# EAGLE design XT-02_Eyecillator_CEMC (EAGLE 9.6.2)
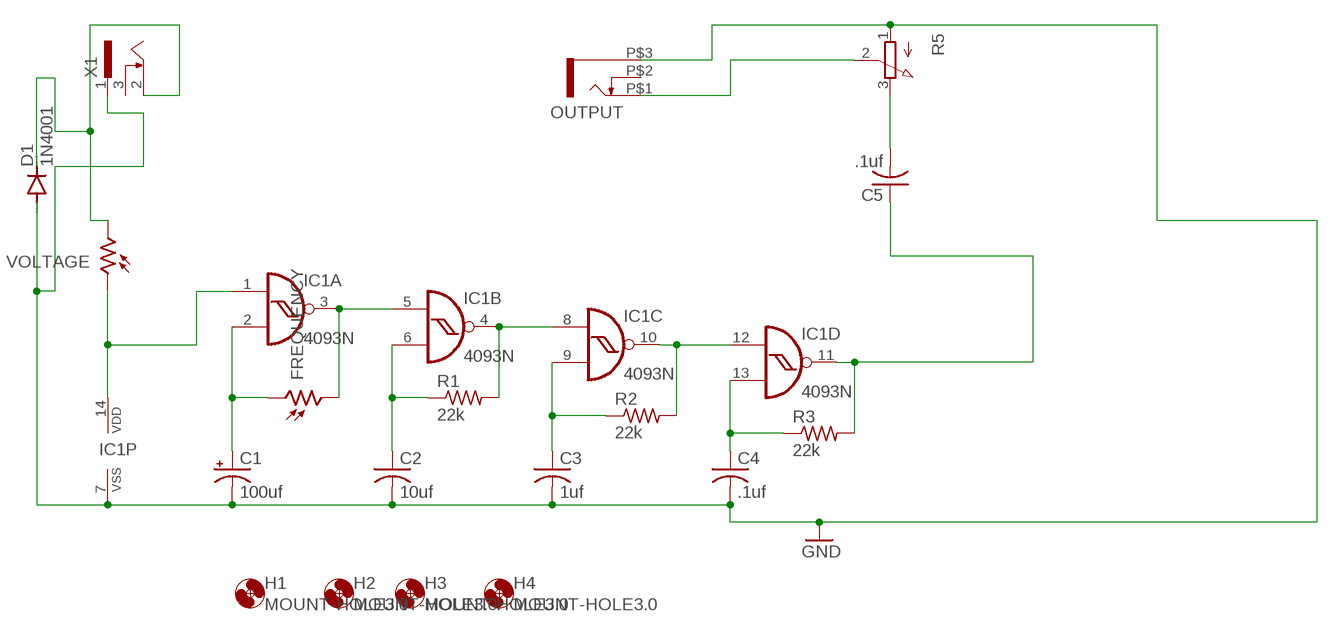
[diagram p0: schematic, sheet 1]

## Parts
C1  100uf  CPOL-USE2,5-6E  [E2,5-6E]
C2  10uf  C-US050-025X075  [C050-025X075]
C3  1uf  C-US050-025X075  [C050-025X075]
C4  .1uf  C-US050-025X075  [C050-025X075]
C5  .1uf  C-US050-025X075  [C050-025X075]
D1  1N4001  1N4004  [DO41-10]
FREQUENCY  VT90N1  [VT900]
H1  MOUNT-HOLE3.0  [3,0]
H2  MOUNT-HOLE3.0  [3,0]
H3  MOUNT-HOLE3.0  [3,0]
H4  MOUNT-HOLE3.0  [3,0]
IC1  4093N  [DIL14]
OUTPUT  WQP-PJ301M-12_JACK  [WQP-PJ301M-12_JACK]
R1  22k  R-US_0207/7  [0207/7]
R2  22k  R-US_0207/7  [0207/7]
R3  22k  R-US_0207/7  [0207/7]
R5  EVUF2L  [EVUFXL]
VOLTAGE  VT90N1  [VT900]
X1  SCD-014A  [SCD-014-A]

## Nets
GND: C1.- C2.2 C3.2 C4.2 D1.A IC1.7(P:VSS) OUTPUT.P$3 R5.1(A) X1.1
N$1: FREQUENCY.2 IC1.3(A:O) IC1.5(B:I0)
N$2: IC1.4(B:O) IC1.8(C:I0) R1.2
N$3: IC1.10(C:O) IC1.12(D:I0) R2.2
N$4: C1.+ FREQUENCY.1 IC1.2(A:I1)
N$5: C2.1 IC1.6(B:I1) R1.1
N$6: C3.1 IC1.9(C:I1) R2.1
N$7: C4.1 IC1.13(D:I1) R3.1
N$8: C5.2 R5.3(E)
N$9: IC1.1(A:I0) IC1.14(P:VDD) VOLTAGE.1
N$10: C5.1 IC1.11(D:O) R3.2
N$11: OUTPUT.P$1 R5.2(S)
N$18: D1.C VOLTAGE.2 X1.2
Unconnected: OUTPUT.P$2 X1.3

## Library data of the parts
C1 = rcl:CPOL-US: POLARIZED CAPACITOR, American symbol; SPICEPREFIX: C
C2-C5 = rcl:C-US: CAPACITOR, American symbol; SPICEPREFIX: C
D1 = diode:1N4004: DIODE general purpose rectifier, 1 A
FREQUENCY VOLTAGE = photo-elements:VT9: Photoconductive Cell VT900 Series Source: http://optoelectronics.perkinelmer.com/content/Datasheets/DTS_vt900seriesdatasheet.pdf
H1-H4 = holes:MOUNT-HOLE: MOUNTING HOLE with drill center marker
IC1 = 40xx:4093: Quad 2-input NAND schmitt trigger
OUTPUT = thonkiconn:WQP-PJ301M-12_JACK
R1-R3 = rcl:R-US_: RESISTOR, American symbol; SPICEPREFIX: R
R5 = pot:EVU: 9 mm Square Rotary Potentiometers Source: Panasonic
X1 = con-shiua-chyuan:SCD-014A: Power Jack 2.5mm; OC_FARNELL: unknown; OC_NEWARK: unknown

## Board
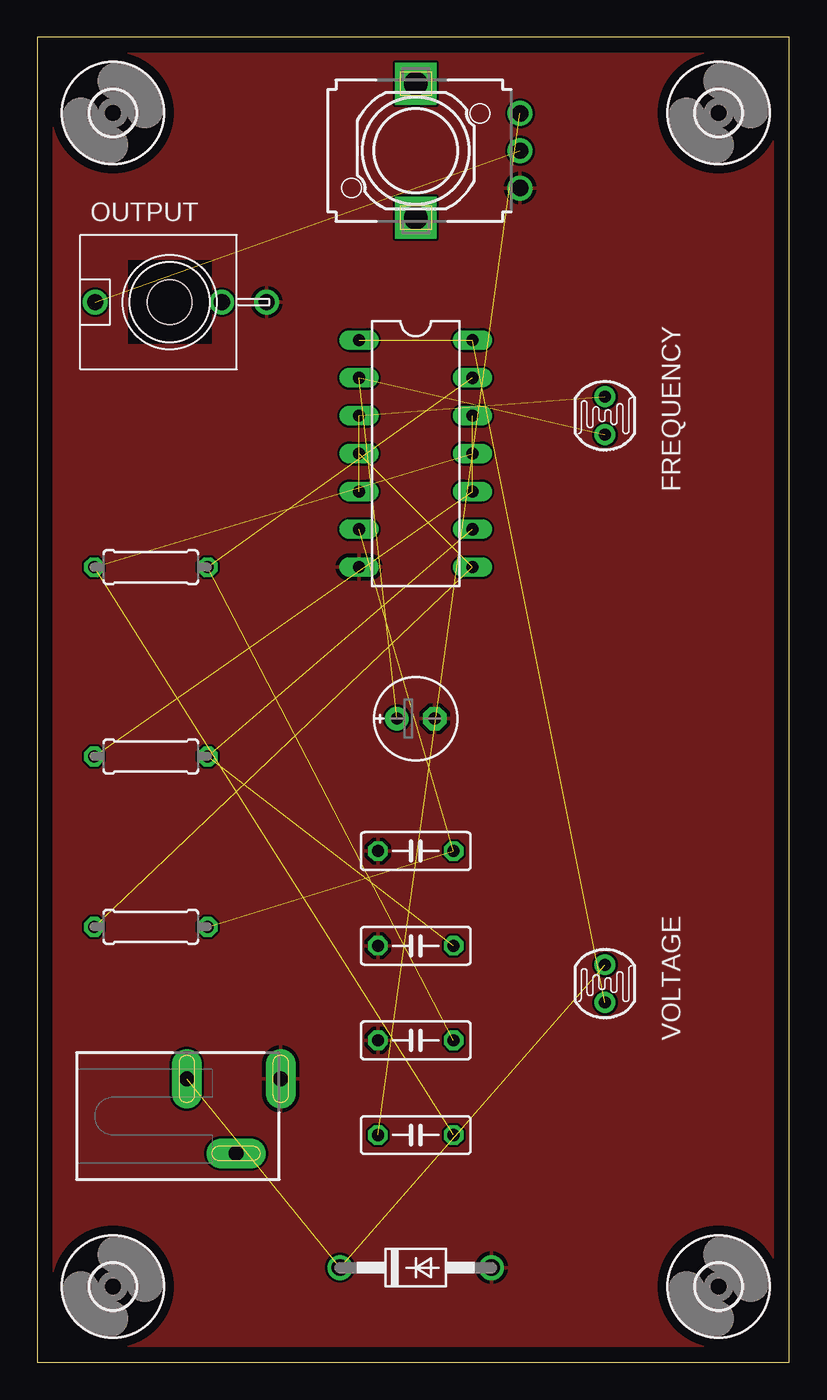
[diagram p1: board, top side]
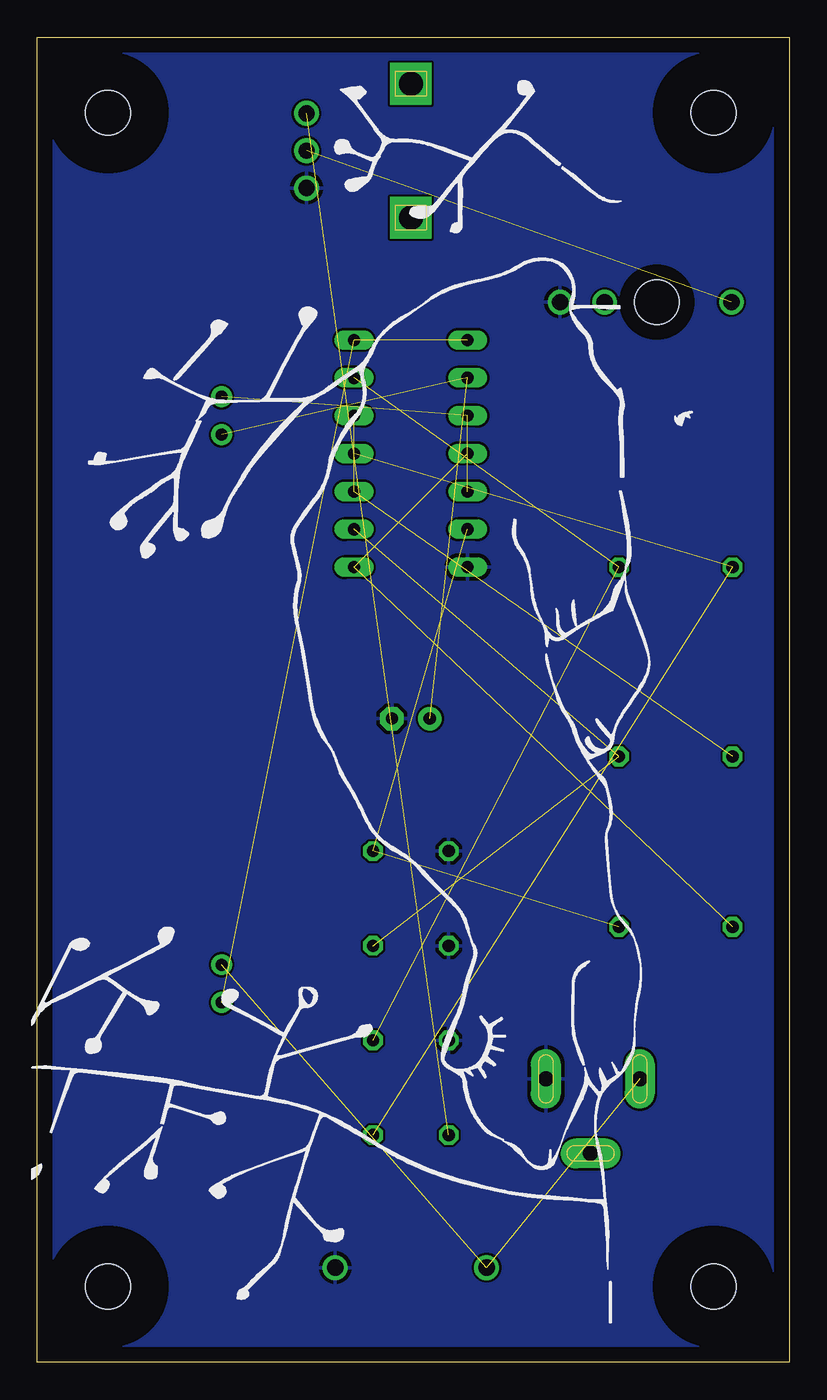
[diagram p2: board, bottom side, seen from below]

Size 50.47 x 88.89 mm. Coordinates in mm from the lower left corner, seen from the top.
Outline: 0,0 50.47,0 50.47,88.89 0,88.89 0,0
Copper layers (1*16): Top 0.035mm / dielectric 1.5mm / Bottom 0.035mm
Design rules "default": minimum track width 6mil, minimum drill 0.35mm, track to track 6mil, track to pad 6mil, pad to pad 6mil, via to via 6mil, smd to smd 6mil, copper to edge 40mil, drill to drill 6mil, minimum pad ring 10mil, minimum via ring 8mil, stop-mask expansion 4mil, vias tented up to drill 0mil, thermal gap 10mil
Holes 3 mm at 8.89,71.12

### Footprints (pad centres in the part's own frame; a part is rotated, then mirrored left to right if it is on the bottom)
E2,5-6E = drill 0.813 pad 1.575: + -1.27,0 | drill 0.813 pad 1.575 octagon: - 1.27,0
C050-025X075 = drill 0.813 octagon: 1 -2.54,0; 2 2.54,0
DO41-10 = drill 1.118: A 5.08,0; C -5.08,0
VT900 = drill 0.8 pad 1.4: 1 -1.27,0; 2 1.27,0
3,0 = hole 3: 0,0
DIL14 = drill 0.813 long: 1 -7.62,-3.81; 2 -5.08,-3.81; 3 -2.54,-3.81; 4 0,-3.81; 5 2.54,-3.81; 6 5.08,-3.81; 7 7.62,-3.81; 8 7.62,3.81; 9 5.08,3.81; 10 2.54,3.81; 11 0,3.81; 12 -2.54,3.81; 13 -5.08,3.81; 14 -7.62,3.81
WQP-PJ301M-12_JACK = drill 1.1: P$1 0,5; P$2 0,-3.5; P$3 0,-6.5
0207/7 = drill 0.813 octagon: 1 -3.81,0; 2 3.81,0
EVUFXL = drill 1.1 pad 1.676: 1 -2.5,-7; 2 0,-7; 3 2.5,-7 | drill 1.6 pad 2.8 square: M1 4.5,0; M2 -4.5,0
SCD-014-A = drill 1 pad 2 long: 1 -2.5,13.8; 2 -2.5,7.5; 3 2.5,10.8

### Placement (x,y rotation side)
C1  25.4,43.18 0 top
C2  25.4,34.29 180 top
C3  25.4,27.94 180 top
C4  25.4,21.59 180 top
C5  25.4,15.24 180 top
D1  25.4,6.35 0 top
FREQUENCY  38.1,63.5 90 top
H1  45.72,83.82 0 top
H2  5.08,83.82 0 top
H3  45.72,5.08 0 top
H4  5.08,5.08 0 top
IC1  25.4,60.96 270 top
OUTPUT  8.89,71.12 90 top
R1  7.62,29.21 180 top
R2  7.62,40.64 180 top
R3  7.62,53.34 180 top
R5  25.4,81.28 90 top
VOLTAGE  38.1,25.4 90 top
X1  2.54,16.51 270 top

### Tracks (layer width: path | path; a pad name or v marks a point on that pad's centre or on a via)
GND
  pour Top: 0,88.9 50.8,88.9 50.8,0 0,0
  pour Bottom: 0,88.9 50.8,88.9 50.8,0 0,0
N$1  (2 unrouted)
N$2  (2 unrouted)
N$3  (2 unrouted)
N$4  (2 unrouted)
N$5  (2 unrouted)
N$6  (2 unrouted)
N$7  (2 unrouted)
N$8  (1 unrouted)
N$9  (2 unrouted)
N$10  (2 unrouted)
N$11  (1 unrouted)
N$18  (2 unrouted)